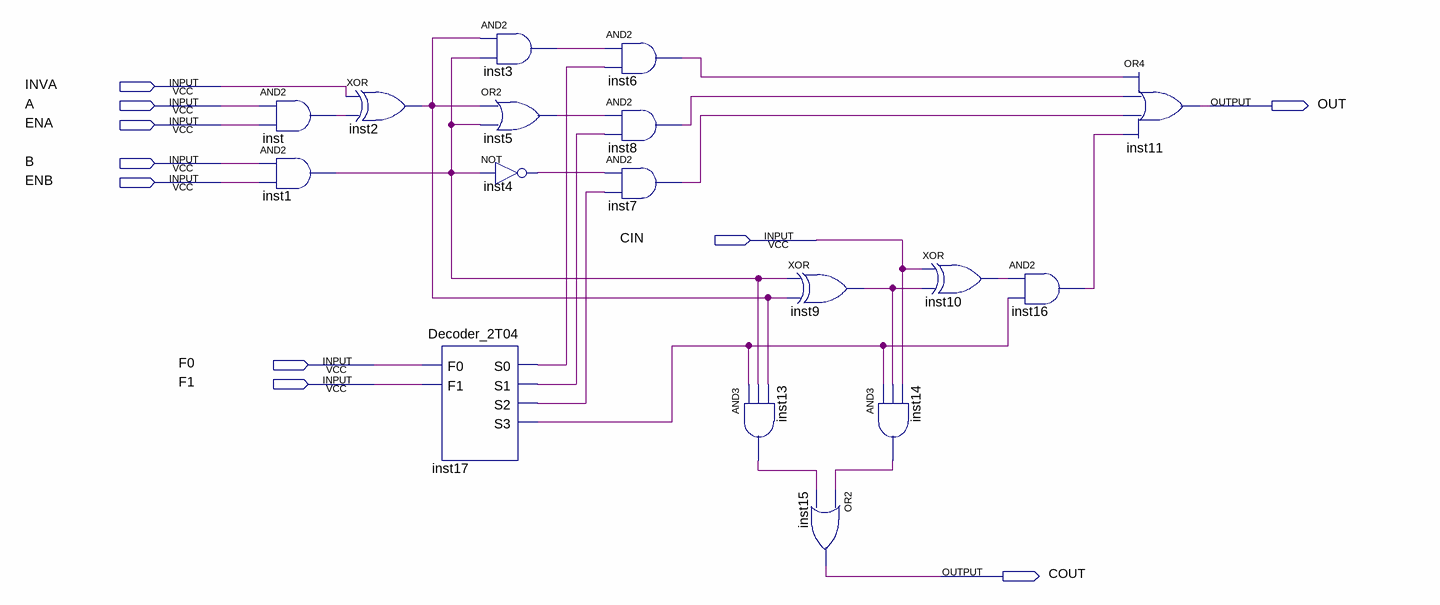
[diagram p0: schematic sheet]
// Quartus schematic ULA_1bit.bdf as structural Verilog: 17 symbols, 10 pins
module ULA_1bit (
  input  INVA,
  input  A,
  input  ENA,
  input  B,
  input  ENB,
  input  CIN,
  input  F0,
  input  F1,
  output OUT,
  output COUT
);

  wire inst1_out, inst2_out, inst3_out, inst4_out, inst5_out, inst6_out, inst7_out, inst8_out, inst9_out,
       inst10_out, inst13_out, inst14_out, inst16_out, inst17_s0, inst17_s1, inst17_s2, inst17_s3, inst_out;

  and inst (inst_out, A, ENA);
  and inst1 (inst1_out, B, ENB);
  xor inst2 (inst2_out, INVA, inst_out);
  and inst3 (inst3_out, inst2_out, inst1_out);
  or inst5 (inst5_out, inst2_out, inst1_out);
  not inst4 (inst4_out, inst1_out);
  Decoder_2T04 inst17 (.F0(F0), .F1(F1), .S3(inst17_s3), .S2(inst17_s2), .S1(inst17_s1), .S0(inst17_s0));
  and inst6 (inst6_out, inst3_out, inst17_s0);
  and inst8 (inst8_out, inst5_out, inst17_s1);
  and inst7 (inst7_out, inst4_out, inst17_s2);
  xor inst9 (inst9_out, inst1_out, inst2_out);
  and inst13 (inst13_out, inst17_s3, inst1_out, inst2_out);
  or inst15 (COUT, inst14_out, inst13_out);
  and inst14 (inst14_out, inst17_s3, inst9_out, CIN);
  xor inst10 (inst10_out, CIN, inst9_out);
  and inst16 (inst16_out, inst10_out, inst17_s3);
  or inst11 (OUT, inst6_out, inst8_out, inst7_out, inst16_out);
endmodule
